# Altium schematic sheet Модуль канала измерения.SchDoc
size 420 x 297 mm; ApprovedBy: Кузьмич; CheckedBy: Папковский; DrawnBy: Стречень; Organization: НИЧ БГУИР; DocumentNumber: ГЛЮИ.145678.001 Э3; SheetNumber: 1; PageSetup: Record=PageOptions|CenterHorizontal=True|CenterVertical=True|PrintScale=0.67|XCorrection=1.00|YCorrection=1.00|PrintKind=2|BorderSize=5000000|LeftOffset=0|BottomOffset=0|Orientation=2|PaperLength=1000|PaperWidth=1000|Scale=100|PaperSource=7|PrintQuality=-4|MediaType=1|DitherType=10|PrintScaleMode=1|PaperKind=A4; Title1str: Модуль; Title2str: канала измерения; ProcessInspection: Радевич; NormInspection: Толстухина; DocumentType: Схема электрическая принципиальная; ImagePath: ГЛЮИ.145678.001; ProjectName: Модуль
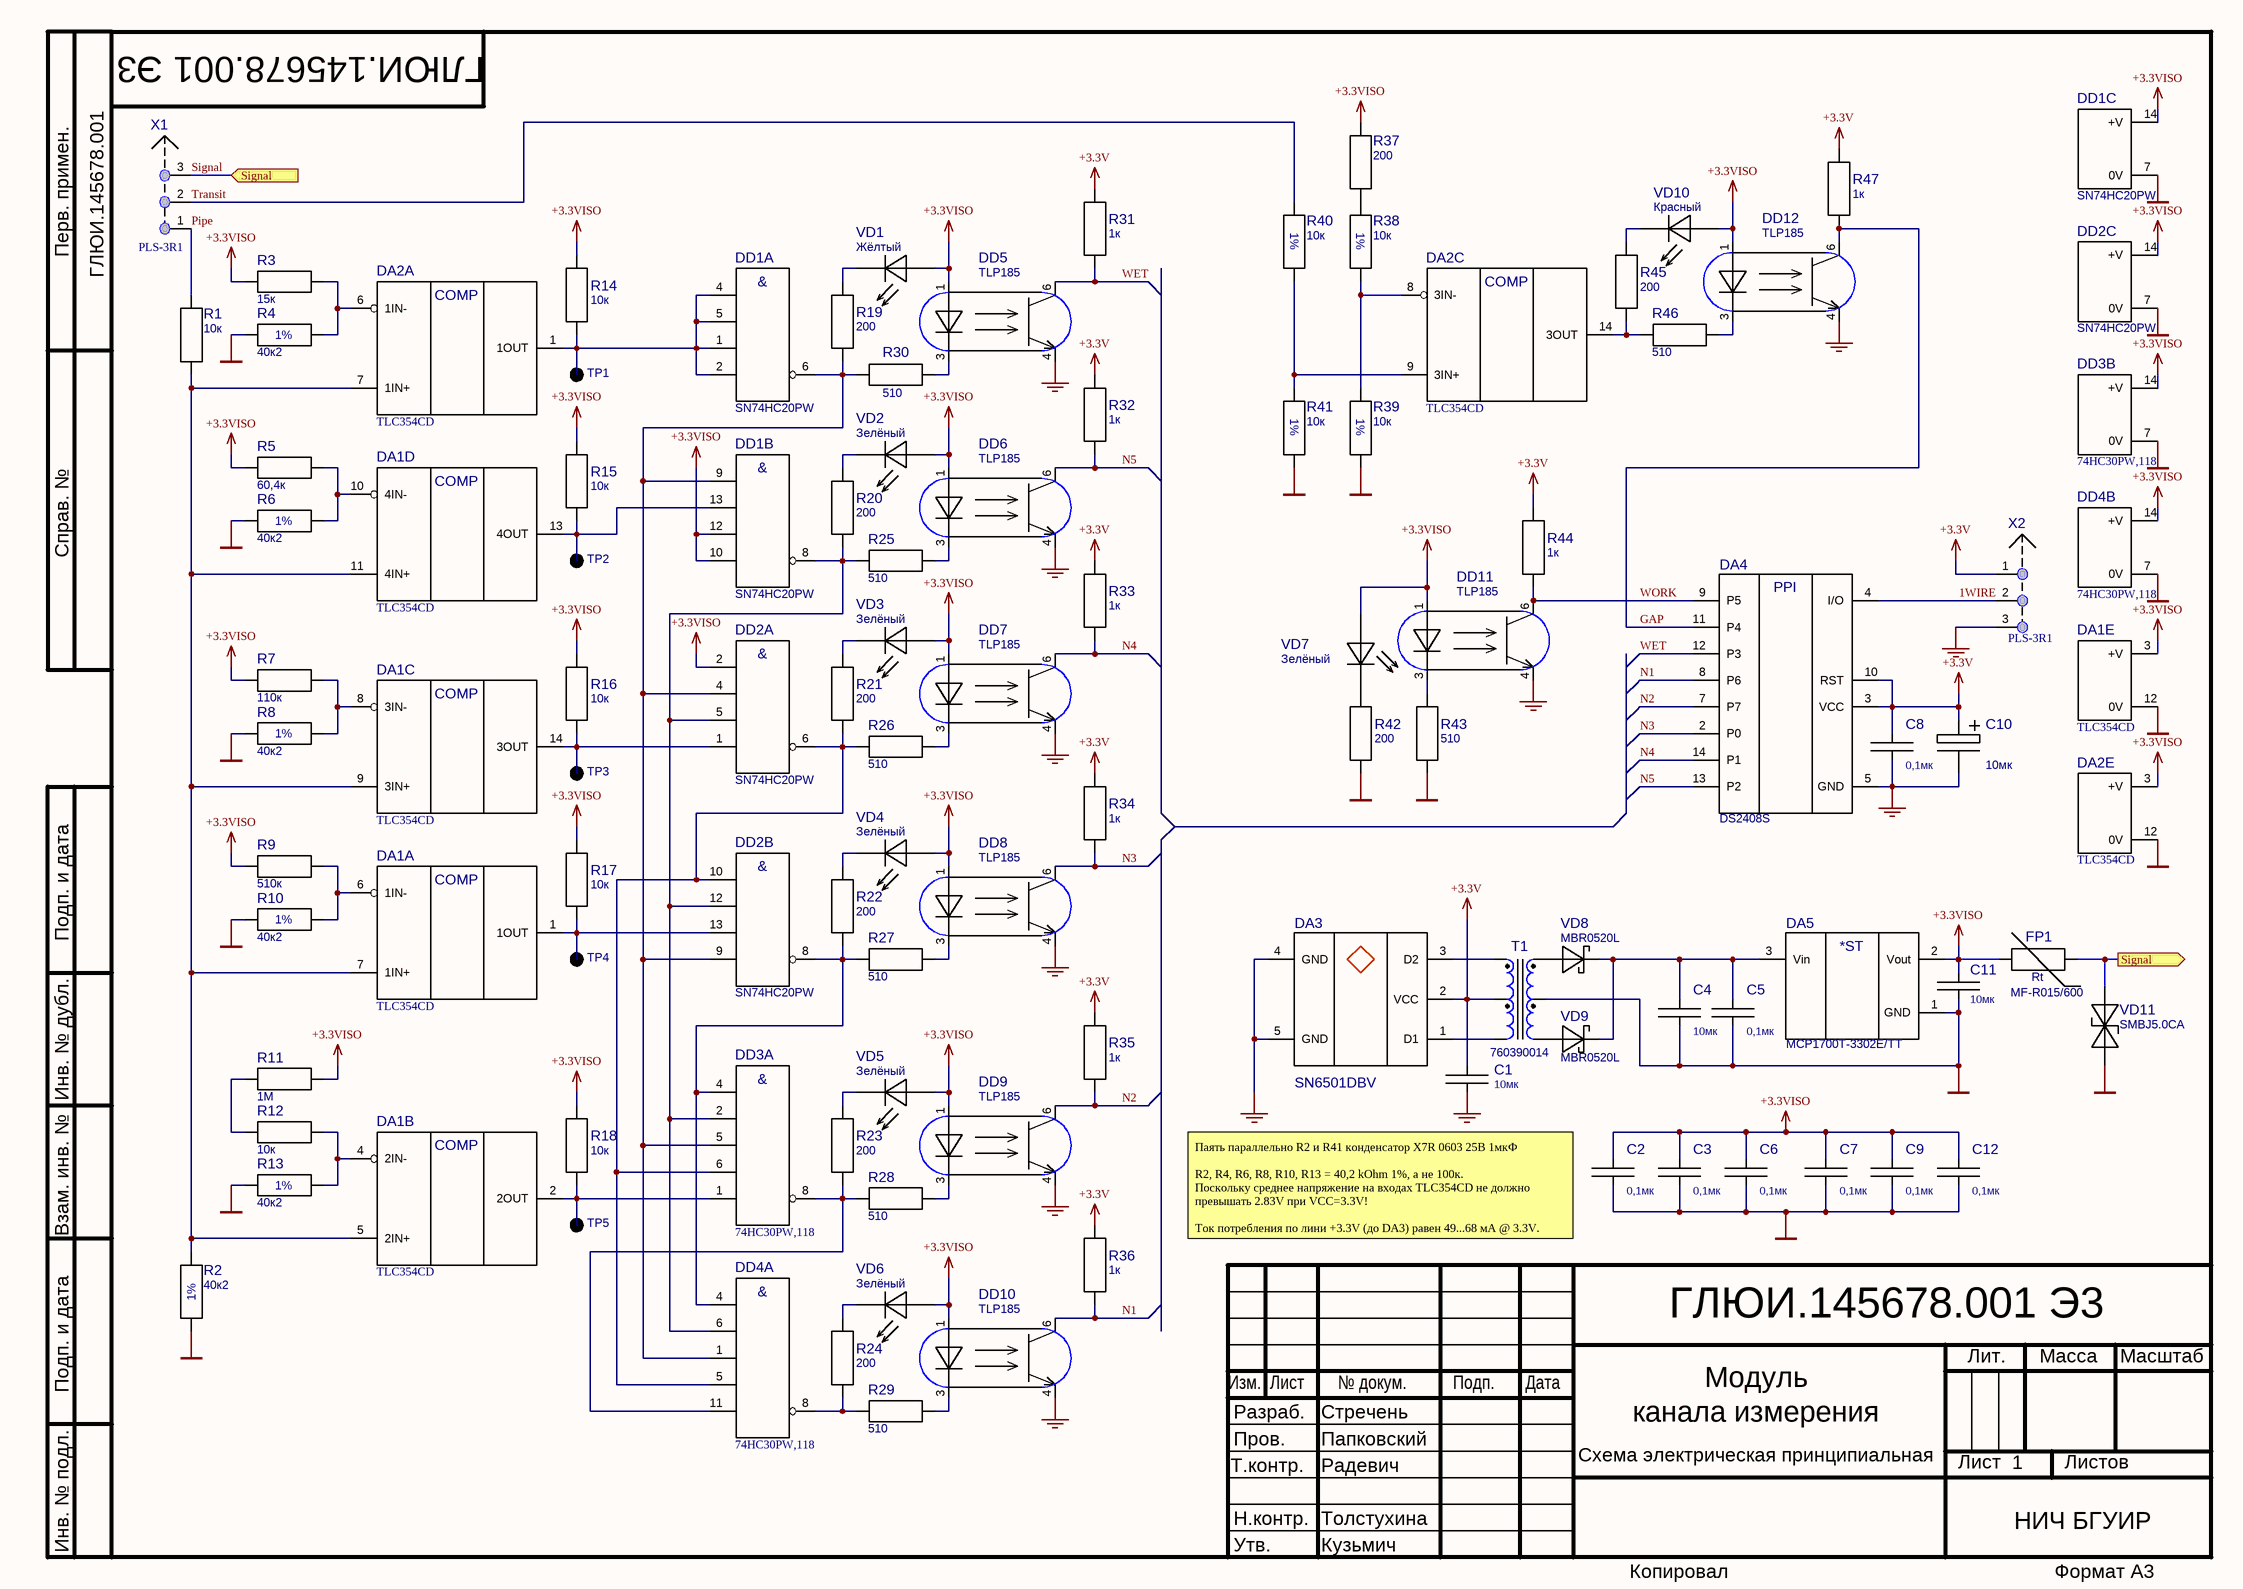
[diagram p0: Модуль канала измерения.SchDoc]

## Parts
C1  10мк  [CAPC2012L]
C2  0,1мк  [CAPC1608L]
C3  0,1мк  [CAPC1608L]
C4  10мк  [CAPC2012L]
C5  0,1мк  [CAPC1608L]
C6  0,1мк  [CAPC1608L]
C7  0,1мк  [CAPC1608L]
C8  0,1мк  [CAPC1608L]
C9  0,1мк  [CAPC1608L]
C10  10мк  [TC3216-1206]
C11  10мк  [CAPC2012L]
C12  0,1мк  [CAPC1608L]
DA1  TLC354CD  [SOIC-14]  (parts A,B,C,D,E of 5)
DA2  TLC354CD  [SOIC-14]  (parts A,C,E of 5)
DA3  SN6501DBV  [SOT-023-5]
DA4  DS2408S  [SOIC16]
DA5  MCP1700T-3302E/TT  [SOT-023-3]
DD1  SN74HC20PW  [TSSOP-14]  (parts A,B,C of 3)
DD2  SN74HC20PW  [TSSOP-14]  (parts A,B,C of 3)
DD3  74HC30PW,118  [TSSOP-14]  (parts A,B of 2)
DD4  74HC30PW,118  [TSSOP-14]  (parts A,B of 2)
DD5  TLP185  [MFSOP6]
DD6  TLP185  [MFSOP6]
DD7  TLP185  [MFSOP6]
DD8  TLP185  [MFSOP6]
DD9  TLP185  [MFSOP6]
DD10  TLP185  [MFSOP6]
DD11  TLP185  [MFSOP6]
DD12  TLP185  [MFSOP6]
FP1  MF-R015/600  [MF-R015/600]
R1  value 10к  [RESC1608L]  (hidden comment: 0603 10 кОм±1 %)
R2  40к2  [RESC1608L]
R3  value 15к  [RESC1608L]  (hidden comment: 0603 15 кОм±1 %)
R4  40к2  [RESC1608L]
R5  value 60,4к  [RESC1608L]  (hidden comment: 0603 60,4 кОм±1 %)
R6  40к2  [RESC1608L]
R7  value 110к  [RESC1608L]  (hidden comment: 0603 110 кОм±1 %)
R8  40к2  [RESC1608L]
R9  value 510к  [RESC1608L]  (hidden comment: 0603 510 кОм±1 %)
R10  40к2  [RESC1608L]
R11  value 1М  [RESC1608L]  (hidden comment: 0603 1 МОм±1 %)
R12  value 10к  [RESC1608L]  (hidden comment: 0603 10 кОм±1 %)
R13  40к2  [RESC1608L]
R14  value 10к  [RESC1608L]  (hidden comment: 0603 10 кОм±5 %)
R15  value 10к  [RESC1608L]  (hidden comment: 0603 10 кОм±5 %)
R16  value 10к  [RESC1608L]  (hidden comment: 0603 10 кОм±5 %)
R17  value 10к  [RESC1608L]  (hidden comment: 0603 10 кОм±5 %)
R18  value 10к  [RESC1608L]  (hidden comment: 0603 10 кОм±5 %)
R19  value 200  [RESC1608L]  (hidden comment: 0603 200 Ом±5 %)
R20  value 200  [RESC1608L]  (hidden comment: 0603 200 Ом±5 %)
R21  value 200  [RESC1608L]  (hidden comment: 0603 200 Ом±5 %)
R22  value 200  [RESC1608L]  (hidden comment: 0603 200 Ом±5 %)
R23  value 200  [RESC1608L]  (hidden comment: 0603 200 Ом±5 %)
R24  value 200  [RESC1608L]  (hidden comment: 0603 200 Ом±5 %)
R25  value 510  [RESC1608L]  (hidden comment: 0603 510 Ом±5 %)
R26  value 510  [RESC1608L]  (hidden comment: 0603 510 Ом±5 %)
R27  value 510  [RESC1608L]  (hidden comment: 0603 510 Ом±5 %)
R28  value 510  [RESC1608L]  (hidden comment: 0603 510 Ом±5 %)
R29  value 510  [RESC1608L]  (hidden comment: 0603 510 Ом±5 %)
R30  value 510  [RESC1608L]  (hidden comment: 0603 510 Ом±5 %)
R31  1к  [RESC1608L]
R32  1к  [RESC1608L]
R33  1к  [RESC1608L]
R34  1к  [RESC1608L]
R35  1к  [RESC1608L]
R36  1к  [RESC1608L]
R37  value 200  [RESC1608L]  (hidden comment: 0603 200 Ом±5 %)
R38  10к  [RESC1608L]
R39  10к  [RESC1608L]
R40  10к  [RESC1608L]
R41  10к  [RESC1608L]
R42  value 200  [RESC1608L]  (hidden comment: 0603 200 Ом±5 %)
R43  value 510  [RESC1608L]  (hidden comment: 0603 510 Ом±5 %)
R44  1к  [RESC1608L]
R45  value 200  [RESC1608L]  (hidden comment: 0603 200 Ом±5 %)
R46  value 510  [RESC1608L]  (hidden comment: 0603 510 Ом±5 %)
R47  1к  [RESC1608L]
T1  760390014  [7603900]
TP1  TP 1mm x 1mm  [1mm x 1mm]  (value not drawn)  (no BOM)
TP2  TP 1mm x 1mm  [1mm x 1mm]  (value not drawn)  (no BOM)
TP3  TP 1mm x 1mm  [1mm x 1mm]  (value not drawn)  (no BOM)
TP4  TP 1mm x 1mm  [1mm x 1mm]  (value not drawn)  (no BOM)
TP5  TP 1mm x 1mm  [1mm x 1mm]  (value not drawn)  (no BOM)
VD1  value Жёлтый  [HSMY-C110]  (hidden comment: HSMY-C110)
VD2  value Зелёный  [HSMG-C110]  (hidden comment: HSMG-C110)
VD3  value Зелёный  [HSMG-C110]  (hidden comment: HSMG-C110)
VD4  value Зелёный  [HSMG-C110]  (hidden comment: HSMG-C110)
VD5  value Зелёный  [HSMG-C110]  (hidden comment: HSMG-C110)
VD6  value Зелёный  [HSMG-C110]  (hidden comment: HSMG-C110)
VD7  value Зелёный  [HSMG-C110]  (hidden comment: HSMG-C110)
VD8  MBR0520L  [SOD-123]
VD9  MBR0520L  [SOD-123]
VD10  value Красный  [HSMS-C110]  (hidden comment: HSMS-C110)
VD11  SMBJ5.0CA  [DO-214AA]
X1  PLS-3R1  [PLS-3R-1 for PBS]
X2  PLS-3R1  [PLS-3R-1 for PBS]

## Ports
Signal (in), Signal (out)

## Nets
+3.3V: C1.2 C8.2 C10.1 DA3.2(VCC) DA4.3(VCC) DA4.10(RST) R31.1 R32.1 R33.1 R34.1 R35.1 R36.1 R44.1 R47.1 T1.2 X2.1
+3.3VISO: C2.2 C3.2 C6.2 C7.2 C9.2 C11.2 C12.2 DA1.3(+V) DA2.3(+V) DA5.2(Vout) DD1.10(B2) DD1.12(C2) DD1.14(+V) DD2.2(B1) DD2.14(+V) DD3.3(C) DD3.11(G) DD3.12(H) DD3.14(+V) DD4.2(B) DD4.3(C) DD4.12(H) DD4.14(+V) DD5.1 DD6.1 DD7.1 DD8.1 DD9.1 DD10.1 DD11.1 DD12.1 FP1.2 R3.1 R5.1 R7.1 R9.1 R11.2 R14.2 R15.2 R16.2 R17.2 R18.2 R37.1 VD1.1 VD2.1 VD3.1 VD4.1 VD5.1 VD6.1 VD7.1 VD10.1
GND: C1.1 C8.1 C10.2 DA3.4(GND) DA3.5(GND) DA4.1(NC) DA4.5(GND) DA4.6(NC) DA4.15(NC) DA4.16(NC) DD5.4 DD6.4 DD7.4 DD8.4 DD9.4 DD10.4 DD11.4 DD12.4 X2.3
GNDISO: C2.1 C3.1 C4.1 C5.1 C6.1 C7.1 C9.1 C11.1 C12.1 DA1.12(0V) DA2.12(0V) DA5.1(GND) DD1.3(NC) DD1.7(0V) DD1.11(NC) DD2.3(NC) DD2.7(0V) DD2.11(NC) DD3.7(0V) DD3.9(NC) DD3.10(NC) DD3.13(NC) DD4.7(0V) DD4.9(NC) DD4.10(NC) DD4.13(NC) R2.1 R4.1 R6.1 R8.1 R10.1 R13.1 R39.2 R41.2 R42.2 R43.1 T1.5 VD11.1
1WIRE: DA4.4(I/O) X2.2
GAP: DA4.11(P4) DD12.6 R47.2
N1: DA4.8(P6) DD10.6 R36.2
N2: DA4.7(P7) DD9.6 R35.2
N3: DA4.2(P0) DD8.6 R34.2
N4: DA4.14(P1) DD7.6 R33.2
N5: DA4.13(P2) DD6.6 R32.2
Pipe: R1.2 X1.1
Signal: FP1.1 VD11.2 X1.3 ; port Signal
Transit: R40.1 X1.2
WET: DA4.12(P3) DD5.6 R31.2
WORK: DA4.9(P5) DD11.6 R44.2
NetC4_2: C4.2 C5.2 DA5.3(Vin) VD8.2 VD9.2
NetDA1_1: DA1.1(1OUT) DD2.13(D2) R17.1 TP4.1
NetDA1_2: DA1.2(2OUT) DD3.1(A) R18.1 TP5.1
NetDA1_4: DA1.4(2IN-) R12.2 R13.2
NetDA1_5: DA1.5(2IN+) DA1.7(1IN+) DA1.9(3IN+) DA1.11(4IN+) DA2.7(1IN+) R1.1 R2.2
NetDA1_6: DA1.6(1IN-) R9.2 R10.2
NetDA1_8: DA1.8(3IN-) R7.2 R8.2
NetDA1_10: DA1.10(4IN-) R5.2 R6.2
NetDA1_13: DA1.13(4OUT) DD1.13(D2) R15.1 TP2.1
NetDA1_14: DA1.14(3OUT) DD2.1(A1) R16.1 TP3.1
NetDA2_1: DA2.1(1OUT) DD1.1(A1) DD1.2(B1) DD1.4(C1) DD1.5(D1) R14.1 TP1.1
NetDA2_6: DA2.6(1IN-) R3.2 R4.2
NetDA2_8: DA2.8(3IN-) R38.2 R39.1
NetDA2_9: DA2.9(3IN+) R40.2 R41.1
NetDA2_14: DA2.14(3OUT) R45.2 R46.1
NetDA3_1: DA3.1(D1) T1.3
NetDA3_3: DA3.3(D2) T1.1
NetDD1_6: DD1.6(Y1) DD1.9(A2) DD2.4(C1) DD2.9(A2) DD3.5(E) DD4.1(A) R19.1 R30.1
NetDD1_8: DD1.8(Y2) DD2.5(D1) DD2.12(C2) DD3.2(B) DD4.6(F) R20.1 R25.1
NetDD2_6: DD2.6(Y1) DD2.10(B2) DD3.6(F) DD4.5(E) R21.1 R26.1
NetDD2_8: DD2.8(Y2) DD3.4(D) DD4.4(D) R22.1 R27.1
NetDD3_8: DD3.8(Y) DD4.11(G) R23.1 R28.1
NetDD4_8: DD4.8(Y) R24.1 R29.1
NetDD5_3: DD5.3 R30.2
NetDD6_3: DD6.3 R25.2
NetDD7_3: DD7.3 R26.2
NetDD8_3: DD8.3 R27.2
NetDD9_3: DD9.3 R28.2
NetDD10_3: DD10.3 R29.2
NetDD11_3: DD11.3 R43.2
NetDD12_3: DD12.3 R46.2
NetR11_1: R11.1 R12.1
NetR19_2: R19.2 VD1.2
NetR20_2: R20.2 VD2.2
NetR21_2: R21.2 VD3.2
NetR22_2: R22.2 VD4.2
NetR23_2: R23.2 VD5.2
NetR24_2: R24.2 VD6.2
NetR37_2: R37.2 R38.1
NetR42_1: R42.1 VD7.2
NetR45_1: R45.1 VD10.2
NetT1_4: T1.4 VD9.1
NetT1_6: T1.6 VD8.1

## Notes on the sheet
- Паять параллельно R2 и R41 конденсатор X7R 0603 25В 1мкФ
  R2, R4, R6, R8, R10, R13 = 40,2 kOhm 1%, а не 100к.
  Поскольку среднее напряжение на входах TLC354CD не должно превышать 2.83V при VCC=3.3V!
  Ток потребления по лини +3.3V (до DA3) равен 49...68 мА @ 3.3V.
- Перв. примен.
- Справ. №
- Подп. и дата
- Инв. № дубл.
- Взам. инв. №
- Изм.
- Лист
- № докум.
- Подп.
- Дата
- Лит.
- Масса
- Масштаб
- Т.контр.
- Пров.
- Разраб.
- Листов
- Инв. № подл.
- Н.контр.
- Утв.
- Копировал
- Формат А3
- (in symbol 74HC30PW,118 (5NAND), part A) &
- (in symbol 0603 10 кОм±1 %) 1%
- (in symbol 0603 40,2 кОм±1 %) 1%
- (in symbol DS2408S) PPI
- (in symbol MCP1700T-3302E/TT) *ST
- (in symbol MF-R015/600) Rt
- (in symbol SN74HC20PW, part A) &
- (in symbol SN74HC20PW, part B) &
- (in symbol TLC354CD, part A) COMP
- (in symbol TLC354CD, part B) COMP
- (in symbol TLC354CD, part C) COMP
- (in symbol TLC354CD, part D) COMP

## Library data of the parts
C1 C4 C11 = X7R 0805-10 В-10 мкФ±15 %: Price: 1=0.29, 10=0.2, 25=0.1452, 50=0.121, 100=0.1016, 250=0.08228, 500=0.0726, 1000=0.06171 (USD); Supplier 1: Digi-Key; Supplier Part Number 1: 1276-1764-1-ND; ComponentLink1URL: http://www.samsungsem.com/servlet/FileDownload?type=spec&file=CL21B106KPQNNNE.pdf; ComponentLink1Description: http://www.samsungsem.com/servlet/FileDownload?type=spec&file=CL21B106KPQNNNE.pdf
C2 C3 C5-C9 C12 = X7R 0603-50 В-0,1 мкФ±10 %: Price: 1=0.1, 10=0.027, 25=0.0192, 100=0.0125, 250=0.0102, 500=0.00874, 1000=0.00681 (USD); Supplier 1: Digi-Key; Supplier Part Number 1: 311-1344-1-ND; ComponentLink1URL: http://media.digikey.com/pdf/Data%20Sheets/Yageo%20PDFs/Class2,X7R_6.3-50V.pdf; ComponentLink1Description: http://media.digikey.com/pdf/Data%20Sheets/Yageo%20PDFs/Class2,X7R_6.3-50V.pdf
C10 = Танталовый A 10 В-10 мкФ±20 %: Supplier 1: Digi-Key; Supplier Part Number 1: 399-3684-1-ND; Price: 1=0.38, 10=0.337, 50=0.2044, 100=0.1684, 250=0.13468, 500=0.12266, 1000=0.11063 (USD)
DD3 DD4 = 74HC30PW,118 (5NAND): Analog: CD74HC30PWR; Supplier 1: Digi-Key; Supplier Part Number 1: 568-8875-1-ND; ComponentLink1URL: http://www.nxp.com/documents/data_sheet/74HC_HCT30.pdf; ComponentLink1Description: http://www.nxp.com/documents/data_sheet/74HC_HCT30.pdf; Price: 1=0.43, 10=0.335, 25=0.2828, 100=0.2303, 250=0.19076, 500=0.15758, 1000=0.11803 (USD)
DD5-DD12 = TLP185: Analog: TLP181; Supplier 1: Digi-Key; Supplier Part Number 1: TLP185(GBE)-ND; ComponentLink1URL: http://www.semicon.toshiba.co.jp/docs/datasheet/en/Opto/TLP185_en_datasheet_120214.pdf; ComponentLink1Description: http://www.semicon.toshiba.co.jp/docs/datasheet/en/Opto/TLP185_en_datasheet_120214.pdf; Price: 1=0.53, 25=0.3412, 100=0.294, 250=0.26252, 500=0.22576, 1000=0.1743, 2500=0.1575, 5000=0.147 (USD)
FP1 = MF-R015/600: Current - Hold (Ih) (Max): 150mA; Current - Max: 3A; Current - Trip (It): 300mA; R Min/Max: 6.000 ~ 12.00 Ohm; Analog: TRF600-150; Supplier 1: Digi-Key; Supplier Part Number 1: MF-R015/600-0-ND; ComponentLink1URL: http://www.bourns.com/data/global/pdfs/mfr600.pdf; ComponentLink1Description: http://www.bourns.com/data/global/pdfs/mfr600.pdf; Price: 1=0.88, 10=0.795, 25=0.7672, 50=0.6576, 100=0.548, 250=0.53432, 500=0.4521, 1000=0.3973, 2500=0.37675 (USD)
R2 R4 R6 R8 R10 R13 = 0603 40,2 кОм±1 %: Value: 40к2
R31-R36 R44 R47 = 0603 1 кОм±5 %
R38-R41 = 0603 10 кОм±1 %: Value: 10к
T1 = 760390014: Analog: 760390013; Supplier 1: Digi-Key; Supplier Part Number 1: 732-4458-1-ND; ComponentLink1URL: http://katalog.we-online.de/ctm/datasheet/760390014.pdf; ComponentLink1Description: http://katalog.we-online.de/ctm/datasheet/760390014.pdf; Price: 1=1.15, 10=1.06, 100=0.95 (USD)
VD11 = SMBJ5.0CA: Power - Peak Pulse: 600W; Voltage - Breakdown (Min): 6.4V; Supplier 1: Digi-Key; Supplier Part Number 1: SMBJ5.0CABCT-ND; ComponentLink1URL: http://www.bourns.com/data/global/pdfs/SMBJ.pdf; ComponentLink1Description: http://www.bourns.com/data/global/pdfs/SMBJ.pdf; Price: 1=0.44, 10=0.347, 25=0.2932, 100=0.2388, 250=0.1978, 500=0.1634, 1000=0.12238 (USD)
DA1 DA2 = TLC354CD: Supplier 1: Digi-Key; Supplier Part Number 1: 296-10292-5-ND; ComponentLink1URL: http://www.ti.com/lit/ds/symlink/tlc354.pdf; ComponentLink1Description: http://www.ti.com/lit/ds/symlink/tlc354.pdf; Price: 1=1.71, 10=1.54, 25=1.3752, 100=1.2375, 250=1.1, 500=0.9625, 750=0.869, 1000=0.7975 (USD); Value: TLC354CD
DA3 = SN6501DBV: Supplier 1: Digi-Key; Supplier Part Number 1: 296-37700-1-ND; ComponentLink1URL: http://www.ti.com/lit/ds/symlink/sn6501.pdf; ComponentLink1Description: http://www.ti.com/lit/ds/symlink/sn6501.pdf; Price: 1=2.3, 10=2.074, 25=1.8576, 100=1.6704, 250=1.4832, 500=1.296, 750=1.1736, 1000=0.9 (USD)
DA4 = DS2408S: Supplier 1: Digi-Key; Supplier Part Number 1: DS2408S+T&RCT-ND; ComponentLink1URL: http://datasheets.maximintegrated.com/en/ds/DS2408.pdf; ComponentLink1Description: http://datasheets.maximintegrated.com/en/ds/DS2408.pdf; Price: 1=6.65, 10=6.273, 25=5.0184, 50=4.7674, 100=4.3911, 250=4.16528, 500=4.01472 (USD)
DA5 = MCP1700T-3302E/TT: Supplier 1: Digi-Key; Supplier Part Number 1: MCP1700T3302ETTCT-ND; Price: 1=0.44, 10=0.37, 25=0.31, 100=0.28 (USD); ComponentLink1URL: http://www.microchip.com/mymicrochip/filehandler.aspx?ddocname=en011779; ComponentLink1Description: http://www.microchip.com/mymicrochip/filehandler.aspx?ddocname=en011779
DD1 DD2 = SN74HC20PW: Value: SN74HC20PW; Supplier 1: Digi-Key; Supplier Part Number 1: 296-33926-5-ND; ComponentLink1URL: http://www.ti.com/lit/ds/symlink/sn74hc20.pdf; ComponentLink1Description: http://www.ti.com/lit/ds/symlink/sn74hc20.pdf; Price: 1=0.45, 10=0.38, 50=0.3326, 100=0.285, 250=0.247, 500=0.209, 750=0.18051, 1000=0.1615 (USD)
R1 R12 = 0603 10 кОм±1 %: Type: Резистор
R3 = 0603 15 кОм±1 %: Type: Резистор
R5 = 0603 60,4 кОм±1 %: Type: Резистор
R7 = 0603 110 кОм±1 %: Type: Резистор
R9 = 0603 510 кОм±1 %: Type: Резистор
R11 = 0603 1 МОм±1 %: Type: Резистор
R14-R18 = 0603 10 кОм±5 %: Type: Резистор
R19-R24 R37 R42 R45 = 0603 200 Ом±5 %: Type: Резистор
R25-R30 R43 R46 = 0603 510 Ом±5 %: Type: Резистор
VD1 = HSMY-C110: Supplier 1: Digi-Key; Supplier Part Number 1: 516-1451-1-ND; ComponentLink1URL: http://www.avagotech.com/docs/AV02-0551EN; ComponentLink1Description: http://www.avagotech.com/docs/AV02-0551EN; Price: 1=0.55, 10=0.408, 25=0.3264, 100=0.2162, 250=0.153, 500=0.13056, 1000=0.1 (USD)
VD2-VD7 = HSMG-C110: Supplier 1: Digi-Key; Supplier Part Number 1: 516-1452-1-ND; ComponentLink1URL: http://www.avagotech.com/docs/AV02-0551EN; ComponentLink1Description: http://www.avagotech.com/docs/AV02-0551EN; Price: 1=0.55, 10=0.408, 25=0.3264, 100=0.2162, 250=0.153, 500=0.13056, 1000=0.1 (USD)
VD8 VD9 = MBR0520L: Supplier 1: Digi-Key; Supplier Part Number 1: MBR0520LCT-ND; ComponentLink1URL: http://www.fairchildsemi.com/ds/MB/MBR0520L.pdf; ComponentLink1Description: http://www.fairchildsemi.com/ds/MB/MBR0520L.pdf; Price: 1=0.36, 10=0.327, 25=0.2356, 100=0.1831, 250=0.11508, 500=0.09804, 1000=0.0668 (USD)
VD10 = HSMS-C110: Supplier 1: Digi-Key; Supplier Part Number 1: 516-1449-1-ND; ComponentLink1URL: http://www.avagotech.com/docs/AV02-0551EN; ComponentLink1Description: http://www.avagotech.com/docs/AV02-0551EN; Price: 1=0.55, 10=0.408, 25=0.3264, 100=0.2162, 250=0.153, 500=0.13056, 1000=0.1 (USD)